# Altium project EDVDU.PrjPCB
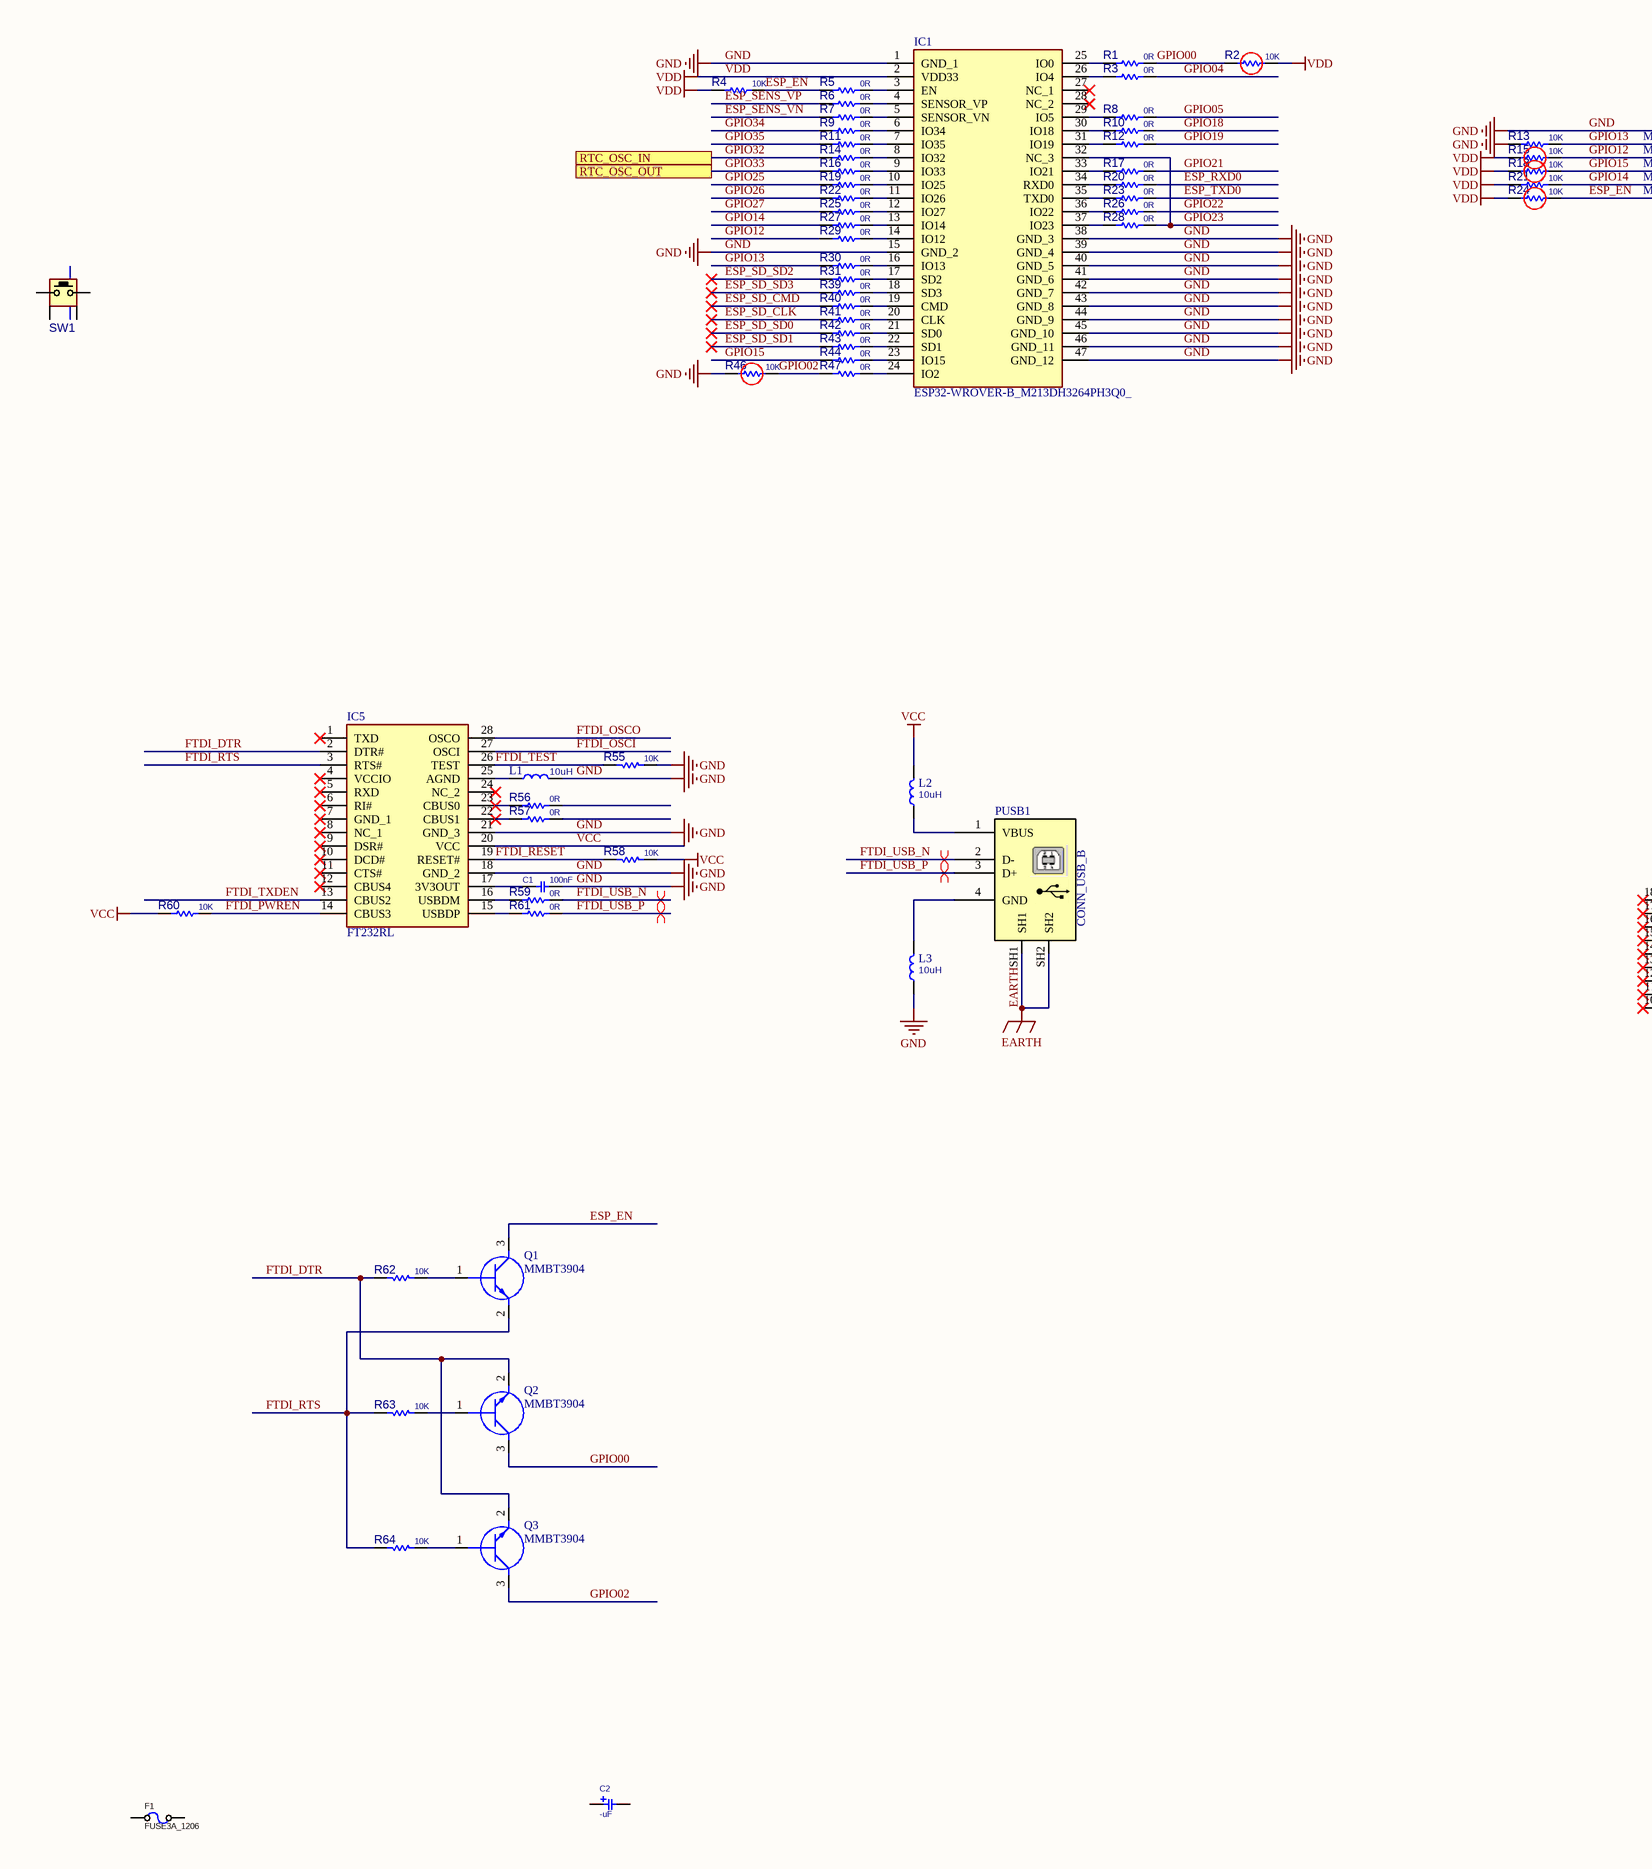
[diagram p0: EDVDU_v2.SchDoc, left]
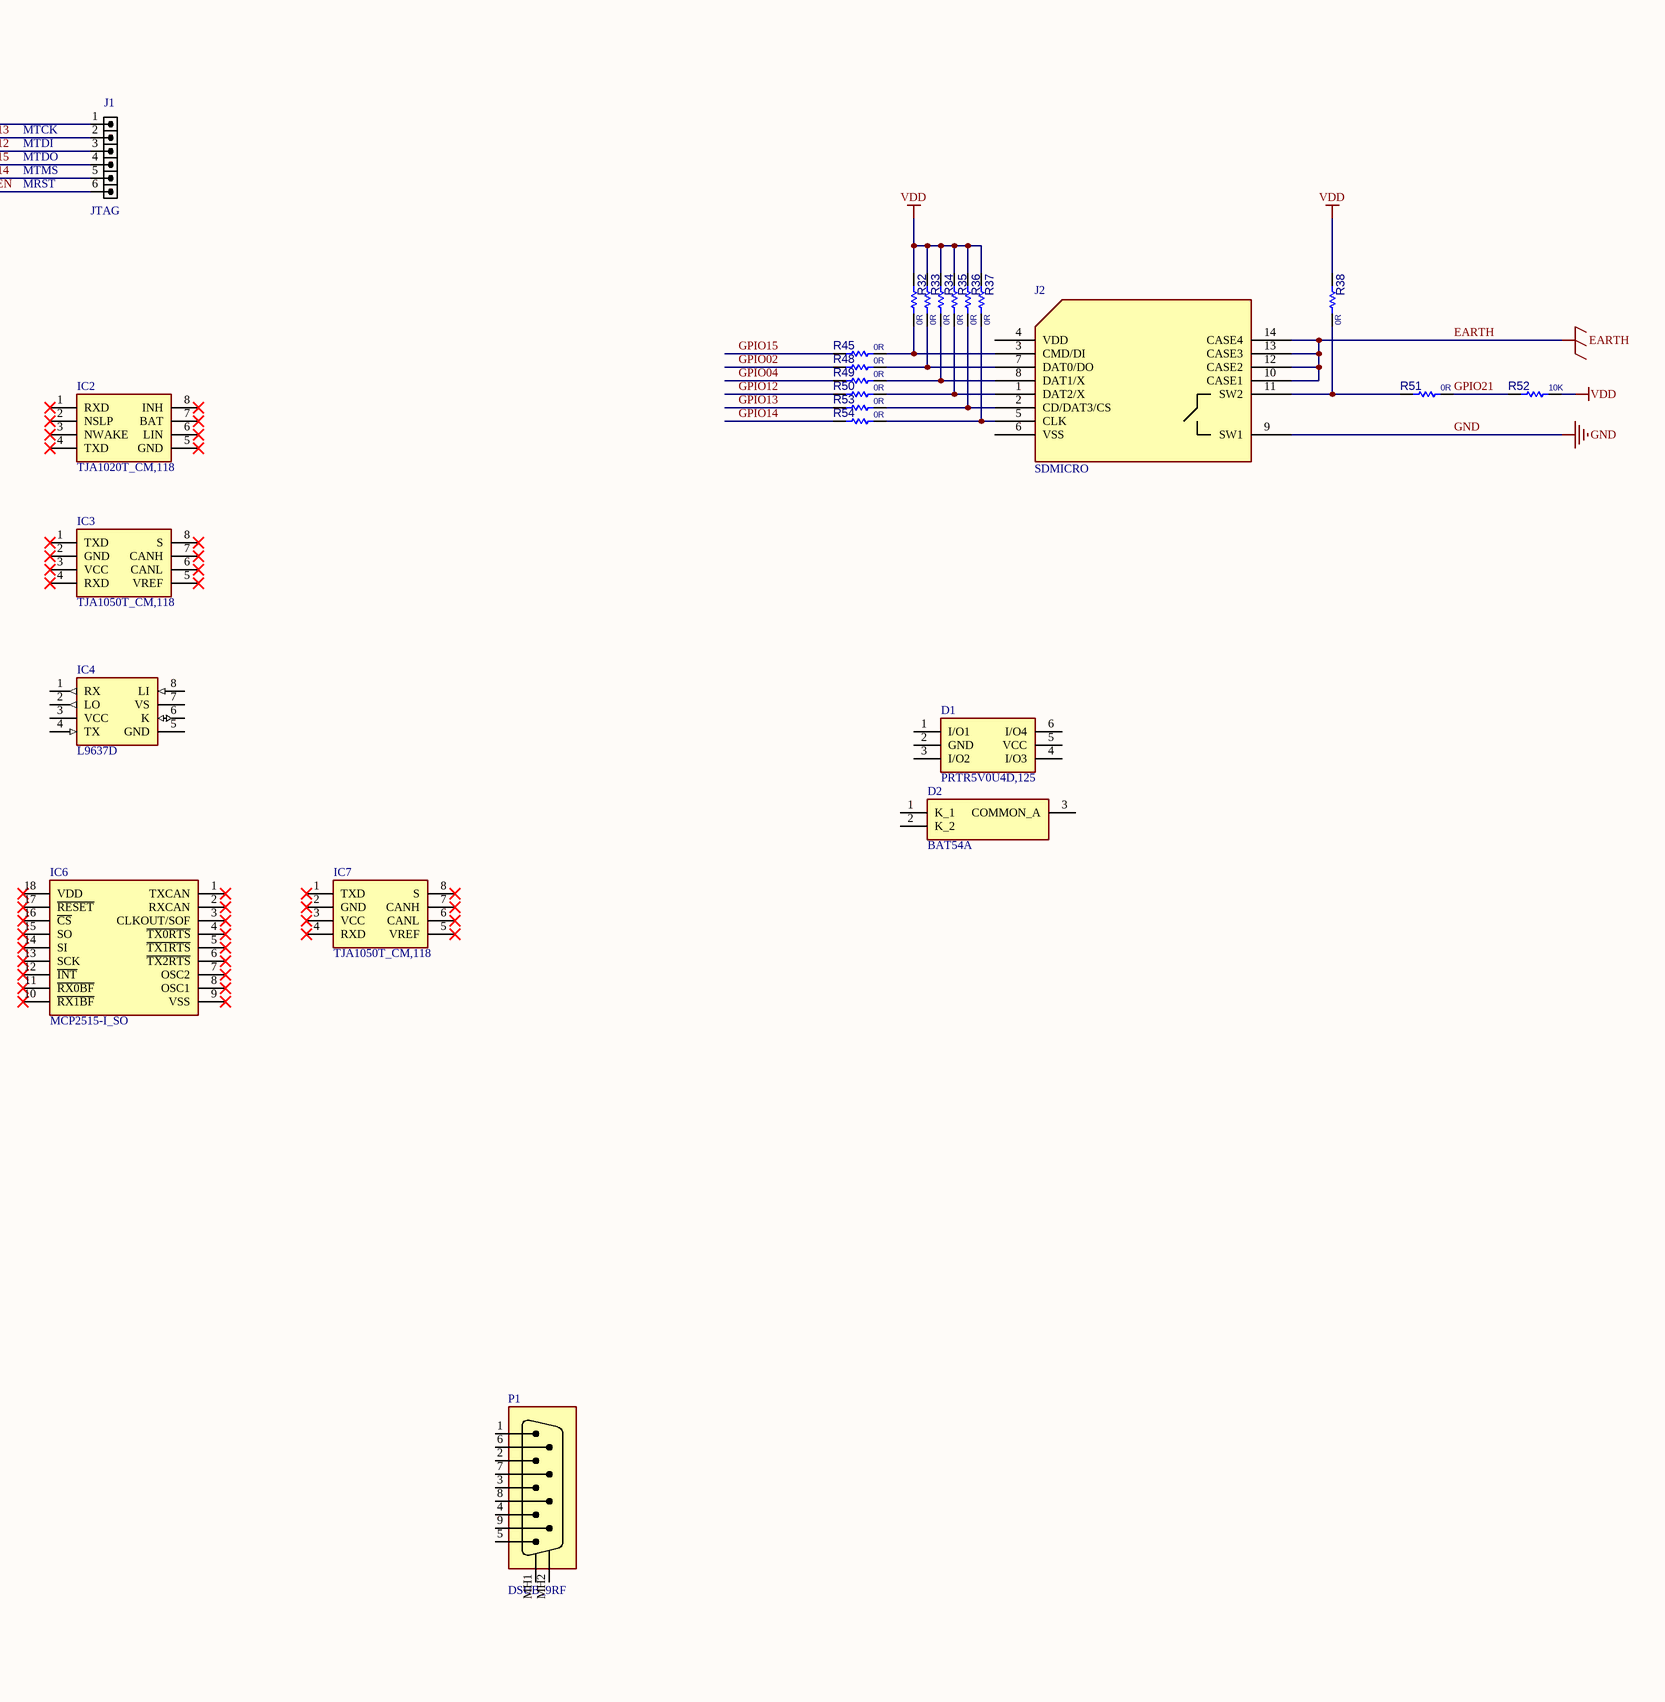
[diagram p1: EDVDU_v2.SchDoc, right]
1 sheet, 87 parts. Net scope: flat (ports and power ports of the same name join across sheets).
Board file: EDVDU_v2.PcbDoc

## Sheet EDVDU_v2.SchDoc
size A0

### Parts
C1  100nF  [C0603]
C2  -uF  [C_TN_3216]
D1  PRTR5V0U4D,125  [SOT95P275X110-6N]
D2  BAT54A  [SOT95P240X110-3N]
F1  FUSE3A_1206  [F1206]
IC1  ESP32-WROVER-B_M213DH3264PH3Q0_  [ESP32WROVERBM213DH3264PH3Q0]
IC2  TJA1020T_CM,118  [SOIC127P600X175-8N]
IC3  TJA1050T_CM,118  [SOIC127P600X175-8N]
IC4  L9637D  [SOIC127P600X175-8N]
IC5  FT232RL  [SOP65P778X200-28N]
IC6  MCP2515-I_SO  [SOIC127P1030X265-18N]
IC7  TJA1050T_CM,118  [SOIC127P600X175-8N]
J1  JTAG  [HDRMINI_M_1X6]
J2  SDMICRO  [SDMICRO_DM3AT]
L1  10uH  [L0603]
L2  10uH  [L1206]
L3  10uH  [L1206]
P1  DSUB_9RF  [DSUB_9RF]
PUSB1  CONN_USB_B  [USB_B_RA_THD]
Q1  MMBT3904  [SOT95P240X120-3N]
Q2  MMBT3904  [SOT95P240X120-3N]
Q3  MMBT3904  [SOT95P240X120-3N]
R1  0R  [R0603]
R2  10K  [R0603]
R3  0R  [R0603]
R4  10K  [R0603]
R5  0R  [R0603]
R6  0R  [R0603]
R7  0R  [R0603]
R8  0R  [R0603]
R9  0R  [R0603]
R10  0R  [R0603]
R11  0R  [R0603]
R12  0R  [R0603]
R13  10K  [R0603]
R14  0R  [R0603]
R15  10K  [R0603]
R16  0R  [R0603]
R17  0R  [R0603]
R18  10K  [R0603]
R19  0R  [R0603]
R20  0R  [R0603]
R21  10K  [R0603]
R22  0R  [R0603]
R23  0R  [R0603]
R24  10K  [R0603]
R25  0R  [R0603]
R26  0R  [R0603]
R27  0R  [R0603]
R28  0R  [R0603]
R29  0R  [R0603]
R30  0R  [R0603]
R31  0R  [R0603]
R32  0R  [R0603]
R33  0R  [R0603]
R34  0R  [R0603]
R35  0R  [R0603]
R36  0R  [R0603]
R37  0R  [R0603]
R38  0R  [R0603]
R39  0R  [R0603]
R40  0R  [R0603]
R41  0R  [R0603]
R42  0R  [R0603]
R43  0R  [R0603]
R44  0R  [R0603]
R45  0R  [R0603]
R46  10K  [R0603]
R47  0R  [R0603]
R48  0R  [R0603]
R49  0R  [R0603]
R50  0R  [R0603]
R51  0R  [R0603]
R52  10K  [R0603]
R53  0R  [R0603]
R54  0R  [R0603]
R55  10K  [R0603]
R56  0R  [R0603]
R57  0R  [R0603]
R58  10K  [R0603]
R59  0R  [R0603]
R60  10K  [R0603]
R61  0R  [R0603]
R62  10K  [R0603]
R63  10K  [R0603]
R64  10K  [R0603]
SW1  PUSHBUTTON  [SWPBT_SPST_R_6X6X6]  (value not drawn)

### Ports
RTC_OSC_IN, RTC_OSC_OUT

### Nets
EARTH: J2.10(CASE1) J2.12(CASE2) J2.13(CASE3) J2.14(CASE4) PUSB1.SH1 PUSB1.SH2
GND: C1.2 IC1.1(GND_1) IC1.15(GND_2) IC1.38(GND_3) IC1.39(GND_4) IC1.40(GND_5) IC1.41(GND_6) IC1.42(GND_7) IC1.43(GND_8) IC1.44(GND_9) IC1.45(GND_10) IC1.46(GND_11) IC1.47(GND_12) IC5.18(GND_2) IC5.21(GND_3) J1.1 J2.9(SW1) L1.2 L3.1 R13.2 R46.2 R55.1
VCC: IC5.20(VCC) L2.2 R58.1 R60.1
VDD: IC1.2(VDD33) R2.2 R4.2 R15.2 R18.2 R21.2 R24.2 R32.2 R33.2 R34.2 R35.2 R36.2 R37.2 R38.2 R52.2
ESP_EN: J1.6 Q1.3(C) R4.1 R5.1 R24.1
ESP_RXD0: R20.2
ESP_SD_CLK: R41.1
ESP_SD_CMD: R40.1
ESP_SD_SD0: R42.1
ESP_SD_SD1: R43.1
ESP_SD_SD2: R31.1
ESP_SD_SD3: R39.1
ESP_SENS_VN: R7.1
ESP_SENS_VP: R6.1
ESP_TXD0: R23.2
FTDI_DTR: IC5.2(DTR#) Q2.2(E) Q3.2(E) R62.2
FTDI_OSCI: IC5.27(OSCI)
FTDI_OSCO: IC5.28(OSCO)
FTDI_PWREN: IC5.14(CBUS3) R60.2
FTDI_RESET: IC5.19(RESET#) R58.2
FTDI_RTS: IC5.3(RTS#) Q1.2(E) R63.2 R64.2
FTDI_TEST: IC5.26(TEST) R55.2
FTDI_TXDEN: IC5.13(CBUS2)
FTDI_USB_N: PUSB1.2(D-) R59.2
FTDI_USB_P: PUSB1.3(D+) R61.2
GPIO00: Q2.3(C) R1.2 R2.1
GPIO02: Q3.3(C) R46.1 R47.1 R48.1
GPIO04: R3.2 R49.1
GPIO05: R8.2
GPIO12: J1.3 R15.1 R29.1 R50.1
GPIO13: J1.2 R13.1 R30.1 R53.1
GPIO14: J1.5 R21.1 R27.1 R54.1
GPIO15: J1.4 R18.1 R44.1 R45.1
GPIO18: R10.2
GPIO19: R12.2
GPIO21: R17.2 R51.2 R52.1
GPIO22: R26.2
GPIO23: IC1.32(NC_3) R28.2
GPIO25: R19.1
GPIO26: R22.1
GPIO27: R25.1
GPIO32: R14.1 ; port RTC_OSC_IN
GPIO33: R16.1 ; port RTC_OSC_OUT
GPIO34: R9.1
GPIO35: R11.1
NetC1_1: C1.1 IC5.17(3V3OUT)
NetIC1_3: IC1.3(EN) R5.2
NetIC1_4: IC1.4(SENSOR_VP) R6.2
NetIC1_5: IC1.5(SENSOR_VN) R7.2
NetIC1_6: IC1.6(IO34) R9.2
NetIC1_7: IC1.7(IO35) R11.2
NetIC1_8: IC1.8(IO32) R14.2
NetIC1_9: IC1.9(IO33) R16.2
NetIC1_10: IC1.10(IO25) R19.2
NetIC1_11: IC1.11(IO26) R22.2
NetIC1_12: IC1.12(IO27) R25.2
NetIC1_13: IC1.13(IO14) R27.2
NetIC1_14: IC1.14(IO12) R29.2
NetIC1_16: IC1.16(IO13) R30.2
NetIC1_17: IC1.17(SD2) R31.2
NetIC1_18: IC1.18(SD3) R39.2
NetIC1_19: IC1.19(CMD) R40.2
NetIC1_20: IC1.20(CLK) R41.2
NetIC1_21: IC1.21(SD0) R42.2
NetIC1_22: IC1.22(SD1) R43.2
NetIC1_23: IC1.23(IO15) R44.2
NetIC1_24: IC1.24(IO2) R47.2
NetIC1_25: IC1.25(IO0) R1.1
NetIC1_26: IC1.26(IO4) R3.1
NetIC1_29: IC1.29(IO5) R8.1
NetIC1_30: IC1.30(IO18) R10.1
NetIC1_31: IC1.31(IO19) R12.1
NetIC1_33: IC1.33(IO21) R17.1
NetIC1_34: IC1.34(RXD0) R20.1
NetIC1_35: IC1.35(TXD0) R23.1
NetIC1_36: IC1.36(IO22) R26.1
NetIC1_37: IC1.37(IO23) R28.1
NetIC5_15: IC5.15(USBDP) R61.1
NetIC5_16: IC5.16(USBDM) R59.1
NetIC5_22: IC5.22(CBUS1) R57.1
NetIC5_23: IC5.23(CBUS0) R56.1
NetIC5_25: IC5.25(AGND) L1.1
NetJ2_1: J2.1(DAT2/X) R35.1 R50.2
NetJ2_2: J2.2(CD/DAT3/CS) R36.1 R53.2
NetJ2_3: J2.3(CMD/DI) R32.1 R45.2
NetJ2_5: J2.5(CLK) R37.1 R54.2
NetJ2_7: J2.7(DAT0/DO) R33.1 R48.2
NetJ2_8: J2.8(DAT1/X) R34.1 R49.2
NetJ2_11: J2.11(SW2) R38.1 R51.1
NetL2_1: L2.1 PUSB1.1(VBUS)
NetL3_2: L3.2 PUSB1.4(GND)
NetQ1_1: Q1.1(B) R62.1
NetQ2_1: Q2.1(B) R63.1
NetQ3_1: Q3.1(B) R64.1

Not connected (* = marked no-connect by the designer): C2 1 2; D1 1(I/O1) 2(GND) 3(I/O2) 4(I/O3) 5(VCC) 6(I/O4); D2 1(K_1) 2(K_2) 3(COMMON_A); F1 1 2; IC1 27(NC_1)* 28(NC_2)*; IC2 1(RXD)* 2(NSLP)* 3(NWAKE)* 4(TXD)* 5(GND)* 6(LIN)* 7(BAT)* 8(INH)*; IC3 1(TXD)* 2(GND)* 3(VCC)* 4(RXD)* 5(VREF)* 6(CANL)* 7(CANH)* 8(S)*; IC4 1(RX) 2(LO) 3(VCC) 4(TX) 5(GND) 6(K) 7(VS) 8(LI); IC5 1(TXD)* 4(VCCIO)* 5(RXD)* 6(RI#)* 7(GND_1)* 8(NC_1)* 9(DSR#)* 10(DCD#)* 11(CTS#)* 12(CBUS4)* 24(NC_2)*; IC6 1(TXCAN)* 2(RXCAN)* 3(CLKOUT/SOF)* 4(~{TX0RTS})* 5(~{TX1RTS})* 6(~{TX2RTS})* 7(OSC2)* 8(OSC1)* 9(VSS)* 10(~{RX1BF})* 11(~{RX0BF})* 12(~{INT})* 13(SCK)* 14(SI)* 15(SO)* 16(~{CS})* 17(~{RESET})* 18(VDD)*; IC7 1(TXD)* 2(GND)* 3(VCC)* 4(RXD)* 5(VREF)* 6(CANL)* 7(CANH)* 8(S)*; J2 4(VDD) 6(VSS); P1 1 2 3 4 5 6 7 8 9 MH1 MH2; R56 2; R57 2; SW1 1 2 MH1 MH2

### Layout directives
differential pair: FTDI_USB_N, FTDI_USB_P

### Notes on the sheet
- MTCK
- MTDI
- MTDO
- MTMS
- MRST

### Library data of the parts
C1 = CAP_SMD_MLCC: CAP, SMD, MLCC; PARAM: 50V; DESC: CAP, MLCC, 1nF, 50V, C0G, 10%, 0402; MANF_P#: MANF_PART#; MANF: Murata; PARAM2: C0G, 10%; PRICE: 100= 1$; ASSEMBLY: ASSEMBLY; VALUE: 100nF
C2 = CAP_SMD_TAN: CAP, SMD, TAN,; PARAM2: -V; VALUE: -uF
D1 = PRTR5V0U4D,125: Diode; Manufacturer_Name: Nexperia; Ordered By: SpaceOmid; Datasheet Link: https://assets.nexperia.com/documents/data-sheet/PRTR5V0U4D.pdf; Height: 1.1mm; Manufacturer_Part_Number: PRTR5V0U4D,125; Mouser Part Number: 771-PRTR5V0U4D-T/R; Mouser Price/Stock: https://www.mouser.co.uk/ProductDetail/Nexperia/PRTR5V0U4D125?qs=LOCUfHb8d9tF9D2ouM%2FWyA%3D%3D; Arrow Part Number: PRTR5V0U4D,125; Arrow Price/Stock: https://www.arrow.com/en/products/prtr5v0u4d125/nexperia?region=europe
D2 = BAT54A: Schottky Diode; Manufacturer_Name: Rectron; Ordered By: SpaceOmid; Datasheet Link: http://www.rectron.com/data_sheets/bat54a.pdf; Height: 1.1mm; Manufacturer_Part_Number: BAT54A; Mouser Part Number: 583-BAT54A; Mouser Price/Stock: https://www.mouser.co.uk/ProductDetail/Rectron/BAT54A?qs=7pEAo90IqNGfs7SPP1chMg%3D%3D; Arrow Part Number: BAT54A; Arrow Price/Stock: https://www.arrow.com/en/products/bat54a/rectron?region=nac
F1 = FUSE_3A_1206_SLOW: Fuse, 3A, 32VDC, 1206, SMD, Slow Blow; PARAM: 3A; 32VDC; Slow Blow; MANF: Bourns; MANF_P#: SF-1206SP300-2; PARAM2: 0.027Ohm; Ordered By: SpaceOmid; PRICE: 0.9$; VALUE: FUSE3A_1206
IC1 = ESP32-WROVER-B_M213DH3264PH3Q0_: Integrated Circuit; Manufacturer_Name: Espressif Systems; Manufacturer_Part_Number: ESP32-WROVER-B(M213DH3264PH3Q0); Datasheet Link: https://www.mouser.com/datasheet/2/891/esp32-wrover-b_datasheet_en-1384674.pdf; Height: 3.4mm; Mouser Part Number: 356-ESP32-WROVER-B; Mouser Price/Stock: https://www.mouser.co.uk/ProductDetail/Espressif-Systems/ESP32-WROVER-BM213DH3264PH3Q0?qs=W%2FMpXkg%252BdQ7xuL5m37Yhrg%3D%3D
IC2 = TJA1020T_CM,118: Integrated Circuit; Manufacturer_Name: NXP; Manufacturer_Part_Number: TJA1020T/CM,118; Datasheet Link: http://www.nxp.com/docs/en/data-sheet/TJA1020.pdf; Height: 1.75mm; Mouser Part Number: 771-TJA1020T/CM118; Mouser Price/Stock: https://www.mouser.co.uk/ProductDetail/NXP-Semiconductors/TJA1020T-CM118?qs=cbprxTG2Yq%252B9fBsR3gYBWA%3D%3D; Arrow Part Number: TJA1020T/CM,118; Arrow Price/Stock: https://www.arrow.com/en/products/tja1020tcm118/nxp-semiconductors?region=nac
IC3 IC7 = TJA1050T_CM,118: Integrated Circuit; Manufacturer_Name: NXP; Manufacturer_Part_Number: TJA1050T/CM,118; Datasheet Link: http://www.nxp.com/docs/en/data-sheet/TJA1050.pdf; Height: 1.75mm; Mouser Part Number: 771-TJA1050T/CM118; Mouser Price/Stock: https://www.mouser.co.uk/ProductDetail/NXP-Semiconductors/TJA1050T-CM118?qs=5XOdhvmYM0NFFspw0VP5sA%3D%3D; Arrow Part Number: TJA1050T/CM,118; Arrow Price/Stock: https://www.arrow.com/en/products/tja1050tcm118/nxp-semiconductors?region=nac
IC4 = L9637D: Integrated Circuit; Manufacturer_Name: STMicroelectronics; Datasheet Link: https://www.st.com/resource/en/datasheet/l9637.pdf; Height: 1.75mm; Manufacturer_Part_Number: L9637D; Mouser Part Number: 511-L9637D; Mouser Price/Stock: https://www.mouser.co.uk/ProductDetail/STMicroelectronics/L9637D?qs=lmFdVnkOgNnwIHpcL%2FXw9g%3D%3D
IC5 = FT232RL: Integrated Circuit; Manufacturer_Name: FTDI Chip; Datasheet Link: http://www.ftdichip.com/Support/Documents/DataSheets/ICs/DS_FT232R.pdf; Height: 2mm; Manufacturer_Part_Number: FT232RL; Arrow Part Number: FT232RL; Arrow Price/Stock: https://www.arrow.com/en/products/ft232rl/ftdi-chip?region=nac
IC6 = MCP2515-I_SO: Integrated Circuit; Manufacturer_Name: Microchip; Manufacturer_Part_Number: MCP2515-I/SO; Datasheet Link: https://datasheet.datasheetarchive.com/originals/distributors/Datasheets-34/DSA-675138.pdf; Height: 2.65mm; Mouser Part Number: 579-MCP2515-I/SO; Mouser Price/Stock: https://www.mouser.co.uk/ProductDetail/Microchip-Technology/MCP2515-I-SO?qs=KwArPi4cUogGDbGnphOvtQ%3D%3D; Arrow Part Number: MCP2515-I/SO; Arrow Price/Stock: https://www.arrow.com/en/products/mcp2515-iso/microchip-technology?region=nac
J1 = HDRMINI_M_1X6: CONN, HEADER, Male, pitch: 1.27mm, 6POS; VALUE: HDRMINI_6
J2 = SOCKET_SDMICRO_DM3AT: CONN MICRO SD R/A PUSH-PUSH SMD; MANF: Hirose; MANF_P#: DM3AT-SF-PEJM5; Ordered By: SpaceOmid; PRICE: 2.6$; VALUE: SDMICRO
L1-L3 = IND_SMD: IND, SMD; VALUE: 10uH
P1 = CONN_DSUB_9RF: CONN, DSUB, HD, 9PIN, R/A, FEMALE, THD; MANF_P#: -; MANF: -; VALUE: DSUB_9RF
PUSB1 = CONN_USB_B_RA_THD: CONN, USB, B, R/A, THD; MANF_P#: 292304-1; MANF: TE Connectivity; VALUE: CONN_USB_B
Q1-Q3 = MMBT3904: Transistor BJT NPN; Manufacturer_Name: onsemi; Ordered By: SpaceOmid; Datasheet Link: https://media.digikey.com/pdf/Data%20Sheets/ON%20Semiconductor%20PDFs/2N3904,MMBT3904,PZT3904.pdf; Height: 1.2mm; Manufacturer_Part_Number: MMBT3904; Mouser Part Number: 512-MMBT3904; Mouser Price/Stock: https://www.mouser.co.uk/ProductDetail/ON-Semiconductor-Fairchild/MMBT3904?qs=UMEuL5FsraCg3xKjS4uBJQ%3D%3D; Arrow Part Number: MMBT3904; Arrow Price/Stock: https://www.arrow.com/en/products/mmbt3904/on-semiconductor; Parameter 1: *
R1-R64 = RES_SMD: RES, SMD; MANF_P#: RK73H1ETTP4701F; MANF: KOA SPEER; PARAM: 0.063W; DESC: DESCRIPTION; DIST#: MOUSER; PARAM2: 1%; ASSEMBLY: ASSEMBLY; PRICE: 100= 0.5$
  R1 R3 R5-R12 R14 R16 R17 R19 R20 R22 R23 R25-R45 R47-R51 R53 R54 R56 R57 R59 R61: VALUE: 0R
  R2 R4 R13 R15 R18 R21 R24 R46 R52 R55 R58 R60 R62-R64: VALUE: 10K
SW1 = SWPBT_SPST_R_6X6X6_SKHHLUA010: SWITCH, PUSH BUTTON, TACTILE, THD, SPST, 6X6X6mm RIGHT; MANF: ALPS; DESC: DESCRIPTION; VALUE: PUSHBUTTON; ASSEMBLY: ASSEMBLY; PARAM: PARAM; PRICE: PRICE; MANF_P#: SKHHLUA010